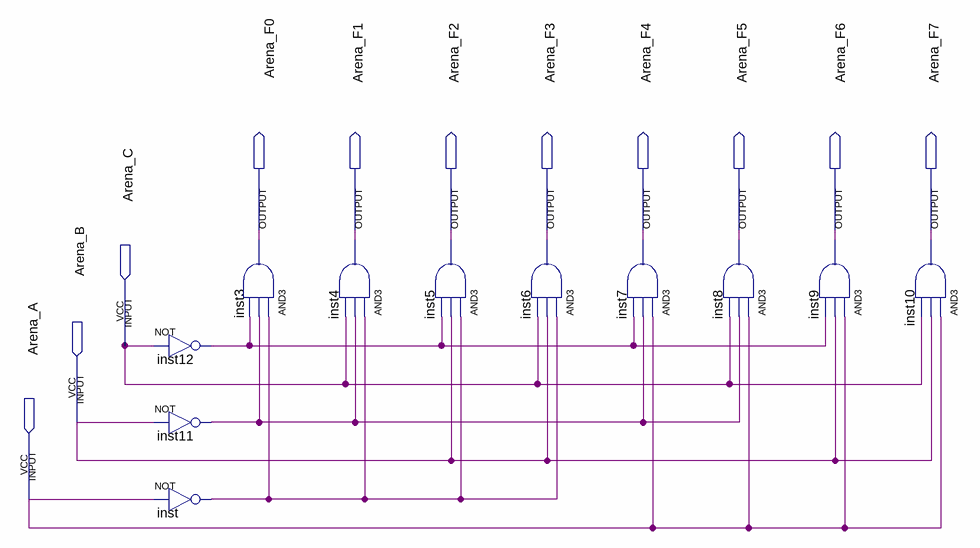
[diagram p0: schematic sheet]
// Quartus schematic Arena_3to8Decoder.bdf as structural Verilog: 11 symbols, 11 pins
module Arena_3to8Decoder (
  input  Arena_C,
  input  Arena_B,
  input  Arena_A,
  output Arena_F0,
  output Arena_F1,
  output Arena_F2,
  output Arena_F3,
  output Arena_F4,
  output Arena_F5,
  output Arena_F6,
  output Arena_F7
);

  wire inst11_out, inst12_out, inst_out;

  not inst12 (inst12_out, Arena_C);
  not inst11 (inst11_out, Arena_B);
  not inst (inst_out, Arena_A);
  and inst3 (Arena_F0, inst_out, inst11_out, inst12_out);
  and inst4 (Arena_F1, inst_out, inst11_out, Arena_C);
  and inst5 (Arena_F2, inst_out, Arena_B, inst12_out);
  and inst6 (Arena_F3, inst_out, Arena_B, Arena_C);
  and inst7 (Arena_F4, Arena_A, inst11_out, inst12_out);
  and inst8 (Arena_F5, Arena_A, inst11_out, Arena_C);
  and inst9 (Arena_F6, Arena_A, Arena_B, inst12_out);
  and inst10 (Arena_F7, Arena_A, Arena_B, Arena_C);
endmodule
